# Altium schematic sheet motorController.SchDoc
size A
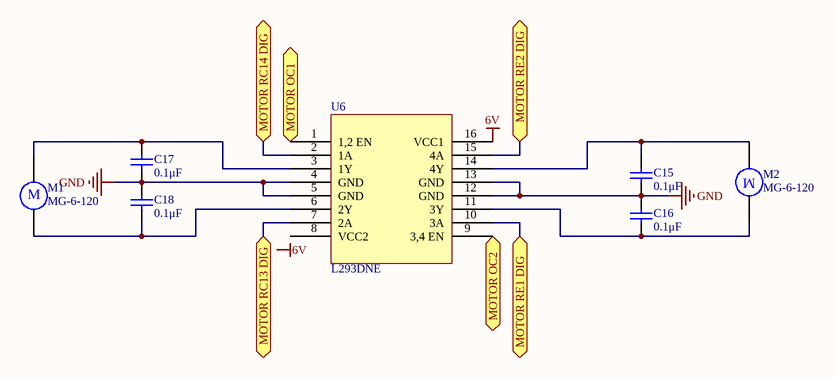
[diagram p0: motorController.SchDoc]

## Parts
C15  0.1μF  [capacitor]
C16  0.1μF  [capacitor]
C17  0.1μF  [capacitor]
C18  0.1μF  [capacitor]
M1  MG-6-120  [Motor2]
M2  MG-6-120  [Motor2]
U6  L293DNE  [MotorDriver]

## Ports
MOTOR OC1, MOTOR OC2, MOTOR RC13 DIG, MOTOR RC14 DIG, MOTOR RE1 DIG, MOTOR RE2 DIG

## Nets
6V: U6.16(VCC1)
GND: C15.2 C16.1 C17.1 C18.2 U6.4(GND) U6.5(GND) U6.12(GND) U6.13(GND)
MOTOR OC1: U6.1(1,2_EN) ; port MOTOR OC1
MOTOR OC2: U6.9(3,4_EN) ; port MOTOR OC2
MOTOR RC13 DIG: U6.7(2A) ; port MOTOR RC13 DIG
MOTOR RC14 DIG: U6.2(1A) ; port MOTOR RC14 DIG
MOTOR RE1 DIG: U6.10(3A) ; port MOTOR RE1 DIG
MOTOR RE2 DIG: U6.15(4A) ; port MOTOR RE2 DIG
NetC15_1: C15.1 M2.2 U6.14(4Y)
NetC16_2: C16.2 M2.1 U6.11(3Y)
NetC17_2: C17.2 M1.1 U6.3(1Y)
NetC18_1: C18.1 M1.2 U6.6(2Y)

Not connected (* = marked no-connect by the designer): U6 8(VCC2)

## Notes on the sheet
- Labels drawn without touching a wire or pin: 6V
- (in symbol Motor) M

## Library data of the parts
C15-C18 = Cap: Capacitor; Published: 8-Jun-2000; LatestRevisionDate: 17-Jul-2002; LatestRevisionNote: Re-released for DXP Platform.; PackageReference: RAD-0.3; Publisher: Altium Limited; PackageDescription: Radial Cap, Thru-Hole; 2 Leads; 0.3 in Pin Spacing; Value: 0.1μF
M1 M2 = Motor: Motor, General Kind; Published: 24-Mar-1999; LatestRevisionDate: 17-Jul-2002; LatestRevisionNote: Re-released for DXP Platform.; PackageReference: RB5-10.5; Publisher: Altium Limited; PackageDescription: Capacitor (Radial); 2 Leads; Olimex Reference: MG-6-120
U6 = Motor Driver: Farnell Reference: 1470423